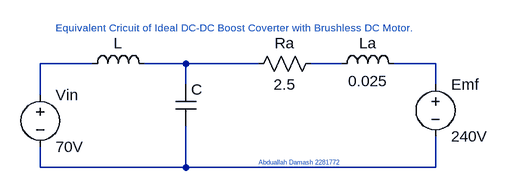
[diagram p0: schematic DC-DC Boost Circuit.asc]
DC-DC Boost Circuit.asc, the LTspice schematic file:
Version 4
SHEET 1 1024 680
WIRE 96 96 16 96
WIRE 240 96 176 96
WIRE 352 96 240 96
WIRE 480 96 432 96
WIRE 624 96 560 96
WIRE 240 128 240 96
WIRE 624 128 624 96
WIRE 16 144 16 96
WIRE 16 256 16 224
WIRE 240 256 240 192
WIRE 240 256 16 256
WIRE 624 256 624 208
WIRE 624 256 240 256
SYMBOL voltage 16 128 R0
WINDOW 123 0 0 Left 0
WINDOW 39 0 0 Left 0
SYMATTR InstName Vin
SYMATTR Value 70V
SYMBOL ind 80 112 R270
WINDOW 0 32 56 VTop 2
WINDOW 3 5 56 VBottom 2
SYMATTR InstName L
SYMATTR Value ""
SYMBOL cap 224 128 R0
SYMATTR InstName C
SYMATTR Value ""
SYMBOL res 448 80 R90
WINDOW 0 0 56 VBottom 2
WINDOW 3 32 56 VTop 2
SYMATTR InstName Ra
SYMATTR Value 2.5
SYMBOL ind 464 112 R270
WINDOW 0 32 56 VTop 2
WINDOW 3 5 56 VBottom 2
SYMATTR InstName La
SYMATTR Value 0.025
SYMBOL voltage 624 112 R0
SYMATTR InstName Emf
SYMATTR Value 240V
TEXT 40 40 Left 1 ;Equivalent Cricuit of Ideal DC-DC Boost Coverter with Brushless DC Motor.
TEXT 352 248 Left 0 ;Abduallah Damash 2281772

The netlist it stands for:
* DC-DC Boost Circuit.asc
Vin N001 N005 70V
L N001 N002
C N002 N005
Ra N003 N002 2.5
La N003 N004 0.025
V§Emf N004 N005 240V
* Equivalent Cricuit of Ideal DC-DC Boost Coverter with Brushless DC Motor.
* Abduallah Damash 2281772
.backanno
.end